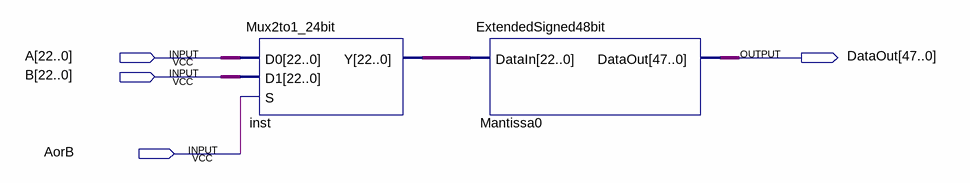
[diagram p0: schematic sheet]
// Quartus schematic MoRongNhan.bdf as structural Verilog: 2 symbols, 4 pins
module MoRongNhan (
  input  [22:0] A,
  input  [22:0] B,
  input  AorB,
  output [47:0] DataOut
);

  wire [22:0] inst_y;

  Mux2to1_24bit inst (.D0(A), .D1(B), .S(AorB), .Y(inst_y));
  ExtendedSigned48bit Mantissa0 (.DataIn(inst_y), .DataOut(DataOut));
endmodule
